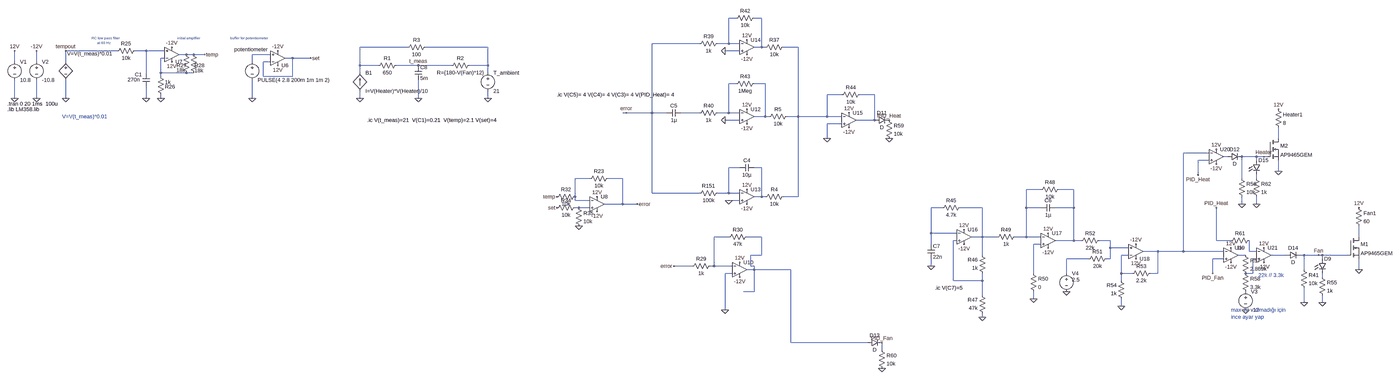
[diagram p0: schematic TRANSFORMERS-ASSEMBLE-9-hizli.asc, whole sheet]
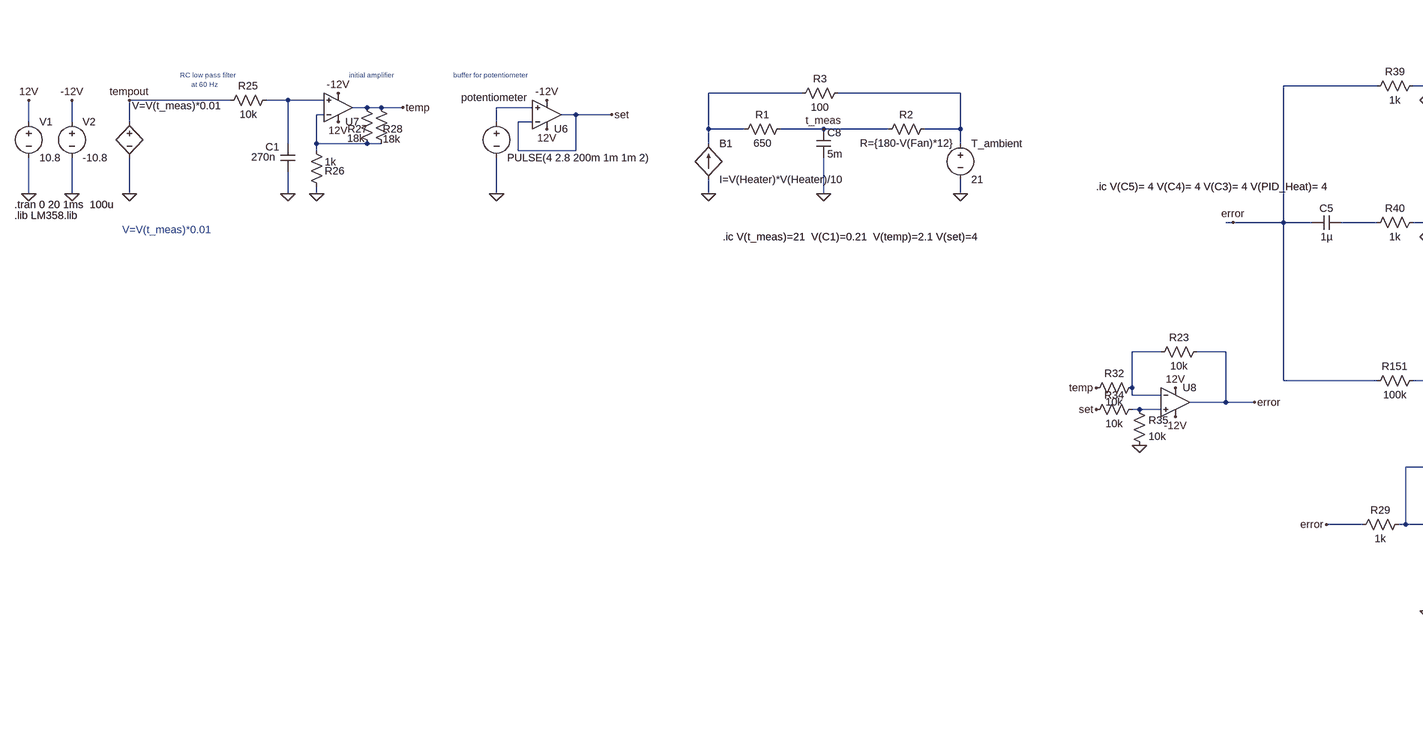
[diagram p1: schematic TRANSFORMERS-ASSEMBLE-9-hizli.asc, part, row 1 of 1, column 1 of 2]
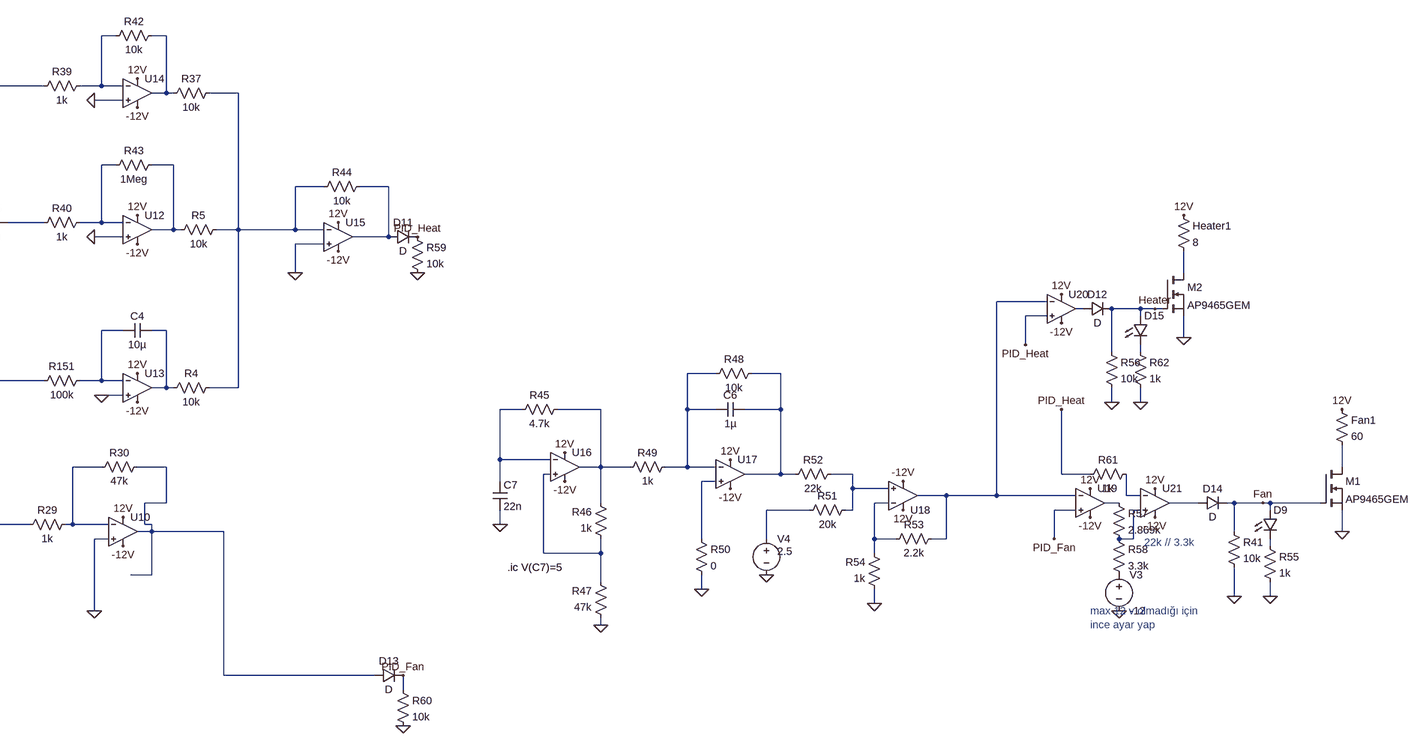
[diagram p2: schematic TRANSFORMERS-ASSEMBLE-9-hizli.asc, part, row 1 of 1, column 2 of 2]
TRANSFORMERS-ASSEMBLE-9-hizli.asc, the LTspice schematic file:
Version 4
SHEET 1 5384 1732
WIRE 2224 -160 2192 -160
WIRE 2336 -160 2304 -160
WIRE 2064 -48 1856 -48
WIRE 2192 -48 2192 -160
WIRE 2192 -48 2144 -48
WIRE 2240 -48 2192 -48
WIRE 576 -32 368 -32
WIRE 928 -32 656 -32
WIRE 2336 -32 2336 -160
WIRE 2336 -32 2304 -32
WIRE 2352 -32 2336 -32
WIRE 2496 -32 2432 -32
WIRE -912 -16 -1136 -16
WIRE -784 -16 -832 -16
WIRE -704 -16 -784 -16
WIRE 2240 -16 2176 -16
WIRE -608 0 -640 0
WIRE -576 0 -608 0
WIRE -528 0 -576 0
WIRE -240 0 -320 0
WIRE -704 16 -720 16
WIRE -144 16 -176 16
WIRE -64 16 -144 16
WIRE -1360 32 -1360 -16
WIRE -1264 32 -1264 -16
WIRE -1136 32 -1136 -16
WIRE -320 32 -320 0
WIRE -240 32 -272 32
WIRE 368 48 368 -32
WIRE 448 48 368 48
WIRE 624 48 528 48
WIRE 768 48 624 48
WIRE 928 48 928 -32
WIRE 928 48 848 48
WIRE -784 80 -784 -16
WIRE -720 80 -720 16
WIRE -608 80 -720 80
WIRE -576 80 -608 80
WIRE 368 80 368 48
WIRE 928 80 928 48
WIRE -720 96 -720 80
WIRE -272 96 -272 32
WIRE -144 96 -144 16
WIRE -144 96 -272 96
WIRE 2224 128 2192 128
WIRE 2352 128 2304 128
WIRE 2720 176 2656 176
WIRE 2864 176 2800 176
WIRE -1360 192 -1360 112
WIRE -1264 192 -1264 112
WIRE -1136 192 -1136 112
WIRE -784 192 -784 144
WIRE -720 192 -720 176
WIRE -320 192 -320 112
WIRE 368 192 368 160
WIRE 624 192 624 112
WIRE 928 192 928 160
WIRE 1744 256 1728 256
WIRE 1856 256 1856 -48
WIRE 1856 256 1744 256
WIRE 1920 256 1856 256
WIRE 2064 256 1984 256
WIRE 2192 256 2192 128
WIRE 2192 256 2144 256
WIRE 2240 256 2192 256
WIRE 2352 272 2352 128
WIRE 2352 272 2304 272
WIRE 2368 272 2352 272
WIRE 2496 272 2496 -32
WIRE 2496 272 2448 272
WIRE 2656 272 2656 176
WIRE 2656 272 2496 272
WIRE 2720 272 2656 272
WIRE 2240 288 2176 288
WIRE 2864 288 2864 176
WIRE 2864 288 2784 288
WIRE 2720 304 2656 304
WIRE 2656 368 2656 304
WIRE 4880 368 4880 320
WIRE 4576 432 4464 432
WIRE 4656 448 4640 448
WIRE 4784 448 4720 448
WIRE 4816 448 4784 448
WIRE 4832 448 4816 448
WIRE 4576 464 4528 464
WIRE 4784 464 4784 448
WIRE 2240 496 2192 496
WIRE 2336 496 2304 496
WIRE 4880 512 4880 464
WIRE 4528 528 4528 464
WIRE 1584 544 1520 544
WIRE 1728 544 1664 544
WIRE 4720 544 4720 448
WIRE 4784 544 4784 528
WIRE 3840 592 3776 592
WIRE 3984 592 3920 592
WIRE 1856 608 1856 256
WIRE 2064 608 1856 608
WIRE 2192 608 2192 496
WIRE 2192 608 2144 608
WIRE 2240 608 2192 608
WIRE 1520 624 1520 544
WIRE 2336 624 2336 496
WIRE 2336 624 2304 624
WIRE 2352 624 2336 624
WIRE 2496 624 2496 272
WIRE 2496 624 2432 624
WIRE 1520 640 1520 624
WIRE 1584 640 1520 640
WIRE 2192 640 2176 640
WIRE 2240 640 2192 640
WIRE 1728 656 1728 544
WIRE 1728 656 1648 656
WIRE 1792 656 1728 656
WIRE 4720 656 4720 624
WIRE 4784 656 4784 624
WIRE 1536 672 1520 672
WIRE 1584 672 1536 672
WIRE 3408 672 3360 672
WIRE 3584 672 3488 672
WIRE 3776 672 3776 592
WIRE 3840 672 3776 672
WIRE 3984 672 3984 592
WIRE 3984 672 3904 672
WIRE 3360 784 3360 672
WIRE 3472 784 3360 784
WIRE 2192 800 2128 800
WIRE 2336 800 2272 800
WIRE 3584 800 3584 672
WIRE 3584 800 3536 800
WIRE 3648 800 3584 800
WIRE 3776 800 3776 672
WIRE 3776 800 3728 800
WIRE 3840 800 3776 800
WIRE 5232 800 5232 752
WIRE 3472 816 3456 816
WIRE 3984 816 3984 672
WIRE 3984 816 3904 816
WIRE 4016 816 3984 816
WIRE 4144 816 4096 816
WIRE 4608 816 4608 672
WIRE 4672 816 4608 816
WIRE 3360 832 3360 784
WIRE 3840 832 3808 832
WIRE 4144 848 4144 816
WIRE 4224 848 4144 848
WIRE 4352 864 4288 864
WIRE 4464 864 4464 432
WIRE 4464 864 4352 864
WIRE 4640 864 4464 864
WIRE 4752 864 4752 816
WIRE 4784 864 4752 864
WIRE 2336 880 2336 800
WIRE 2336 880 2288 880
WIRE 3584 880 3584 800
WIRE 4224 880 4192 880
WIRE 4736 880 4704 880
WIRE 4912 880 4848 880
WIRE 4992 880 4976 880
WIRE 5056 880 4992 880
WIRE 5072 880 5056 880
WIRE 5184 880 5072 880
WIRE 4048 896 3952 896
WIRE 4144 896 4144 848
WIRE 4144 896 4128 896
WIRE 4640 896 4592 896
WIRE 4784 896 4768 896
WIRE 5072 896 5072 880
WIRE 2032 928 1952 928
WIRE 2128 928 2128 800
WIRE 2128 928 2112 928
WIRE 2208 928 2128 928
WIRE 2288 928 2288 880
WIRE 2304 928 2288 928
WIRE 3360 928 3360 896
WIRE 2304 944 2304 928
WIRE 2304 944 2272 944
WIRE 2464 944 2304 944
WIRE 4992 944 4992 880
WIRE 5232 944 5232 896
WIRE 2208 960 2176 960
WIRE 3808 960 3808 832
WIRE 3952 960 3952 896
WIRE 4192 960 4192 880
WIRE 4240 960 4192 960
WIRE 4352 960 4352 864
WIRE 4352 960 4320 960
WIRE 4592 960 4592 896
WIRE 4768 960 4768 896
WIRE 4768 960 4736 960
WIRE 5072 976 5072 960
WIRE 3456 992 3456 816
WIRE 3584 992 3584 960
WIRE 3584 992 3456 992
WIRE 4192 992 4192 960
WIRE 2304 1040 2304 944
WIRE 2304 1040 2256 1040
WIRE 3584 1056 3584 992
WIRE 3808 1072 3808 1040
WIRE 4992 1088 4992 1024
WIRE 5072 1088 5072 1056
WIRE 4192 1104 4192 1072
WIRE 2176 1120 2176 960
WIRE 3584 1152 3584 1136
WIRE 2464 1264 2464 944
WIRE 2832 1264 2464 1264
WIRE 2896 1296 2896 1264
FLAG -1360 192 0
FLAG -1360 -16 12V
FLAG -1264 192 0
FLAG -1264 -16 -12V
FLAG -1136 192 0
FLAG -672 -32 -12V
FLAG -672 32 12V
FLAG -784 192 0
FLAG -720 192 0
FLAG -528 0 temp
FLAG -320 192 0
FLAG -208 -16 -12V
FLAG -208 48 12V
FLAG -64 16 set
FLAG 928 192 0
FLAG 368 192 0
FLAG 624 192 0
FLAG 624 48 t_meas
FLAG -1136 -16 tempout
FLAG 2240 976 -12V
FLAG 2240 912 12V
FLAG 2896 1264 PID_Fan
FLAG 2272 304 -12V
FLAG 2272 240 12V
FLAG 2272 656 -12V
FLAG 2272 592 12V
FLAG 2272 0 -12V
FLAG 2272 -64 12V
FLAG 2752 320 -12V
FLAG 2752 256 12V
FLAG 2656 368 0
FLAG 2928 288 PID_Heat
FLAG 3504 832 -12V
FLAG 3504 768 12V
FLAG 3360 928 0
FLAG 3584 1152 0
FLAG 3808 1072 0
FLAG 3872 848 -12V
FLAG 3872 784 12V
FLAG 4256 832 -12V
FLAG 4256 896 12V
FLAG 4192 1104 0
FLAG 4672 912 -12V
FLAG 4672 848 12V
FLAG 4592 960 PID_Fan
FLAG 5056 880 Fan
FLAG 5232 944 0
FLAG 5072 1088 0
FLAG 4608 480 -12V
FLAG 4608 416 12V
FLAG 4528 528 PID_Heat
FLAG 4816 448 Heater
FLAG 4880 512 0
FLAG 4720 656 0
FLAG 5232 672 12V
FLAG 4880 240 12V
FLAG 4816 912 -12V
FLAG 4816 848 12V
FLAG 4608 672 PID_Heat
FLAG 3952 1040 0
FLAG 2928 368 0
FLAG 2896 1376 0
FLAG 4992 1088 0
FLAG 4784 656 0
FLAG 1616 688 -12V
FLAG 1616 624 12V
FLAG 1536 752 0
FLAG 1440 672 set
FLAG 1440 624 temp
FLAG 1792 656 error
FLAG 2192 640 0
FLAG 2176 288 0
FLAG 2176 -16 0
FLAG 1744 256 error
FLAG 2176 1120 0
FLAG 1952 928 error
FLAG 4736 1120 0
SYMBOL voltage -1360 16 R0
WINDOW 123 0 0 Left 0
WINDOW 39 0 0 Left 0
SYMATTR InstName V1
SYMATTR Value 10.8
SYMBOL voltage -1264 16 R0
WINDOW 123 0 0 Left 0
WINDOW 39 0 0 Left 0
SYMATTR InstName V2
SYMATTR Value -10.8
SYMBOL bv -1136 16 R0
WINDOW 0 -36 10 Invisible 2
WINDOW 3 6 -20 Left 2
SYMATTR InstName B2
SYMATTR Value V=V(t_meas)*0.01
SYMBOL res -816 -32 R90
WINDOW 0 0 56 VBottom 2
WINDOW 3 32 56 VTop 2
SYMATTR InstName R25
SYMATTR Value 10k
SYMBOL cap -800 80 R0
WINDOW 0 -34 8 Left 2
WINDOW 3 -65 30 Left 2
SYMATTR InstName C1
SYMATTR Value 270n
SYMBOL res -736 80 R0
WINDOW 0 34 61 Left 2
WINDOW 3 34 41 Left 2
SYMATTR InstName R26
SYMATTR Value 1k
SYMBOL res -624 -16 R0
WINDOW 0 -27 64 Left 2
WINDOW 3 -28 85 Left 2
SYMATTR InstName R27
SYMATTR Value 18k
SYMBOL res -592 -16 R0
WINDOW 0 19 64 Left 2
WINDOW 3 19 86 Left 2
SYMATTR InstName R28
SYMATTR Value 18k
SYMBOL voltage -320 16 R0
WINDOW 0 -79 -38 Left 2
WINDOW 123 0 0 Left 0
WINDOW 39 0 0 Left 0
SYMATTR InstName potentiometer
SYMATTR Value PULSE(4 2.8 200m 1m 1m 2)
SYMBOL voltage 928 64 R0
WINDOW 123 0 0 Left 0
WINDOW 39 0 0 Left 0
SYMATTR InstName T_ambient
SYMATTR Value 21
SYMBOL res 544 32 R90
WINDOW 0 0 56 VBottom 2
WINDOW 3 32 56 VTop 2
SYMATTR InstName R1
SYMATTR Value 650
SYMBOL res 864 32 R90
WINDOW 0 0 56 VBottom 2
WINDOW 3 32 56 VTop 2
SYMATTR InstName R2
SYMATTR Value R={180-V(Fan)*12}
SYMBOL res 672 -48 R90
WINDOW 0 0 56 VBottom 2
WINDOW 3 32 56 VTop 2
SYMATTR InstName R3
SYMATTR Value 100
SYMBOL Opamps\\UniversalOpamp2 2240 944 R0
SYMATTR InstName U10
SYMBOL Opamps\\UniversalOpamp2 2272 272 R0
SYMATTR InstName U12
SYMBOL Opamps\\UniversalOpamp2 2272 624 R0
SYMATTR InstName U13
SYMBOL Opamps\\UniversalOpamp2 2272 -32 R0
SYMATTR InstName U14
SYMBOL Opamps\\UniversalOpamp2 2752 288 R0
SYMATTR InstName U15
SYMBOL res 2448 -48 R90
WINDOW 0 0 56 VBottom 2
WINDOW 3 32 56 VTop 2
SYMATTR InstName R37
SYMATTR Value 10k
SYMBOL res 2160 -64 R90
WINDOW 0 0 56 VBottom 2
WINDOW 3 32 56 VTop 2
SYMATTR InstName R39
SYMATTR Value 1k
SYMBOL res 2160 240 R90
WINDOW 0 0 56 VBottom 2
WINDOW 3 32 56 VTop 2
SYMATTR InstName R40
SYMATTR Value 1k
SYMBOL res 2160 592 R90
WINDOW 0 0 56 VBottom 2
WINDOW 3 32 56 VTop 2
SYMATTR InstName R151
SYMATTR Value 100k
SYMBOL res 2320 -176 R90
WINDOW 0 0 56 VBottom 2
WINDOW 3 32 56 VTop 2
SYMATTR InstName R42
SYMATTR Value 10k
SYMBOL res 2320 112 R90
WINDOW 0 0 56 VBottom 2
WINDOW 3 32 56 VTop 2
SYMATTR InstName R43
SYMATTR Value 1Meg
SYMBOL cap 2304 480 R90
WINDOW 0 0 32 VBottom 2
WINDOW 3 32 32 VTop 2
SYMATTR InstName C4
SYMATTR Value 10µ
SYMBOL cap 1984 240 R90
WINDOW 0 0 32 VBottom 2
WINDOW 3 32 32 VTop 2
SYMATTR InstName C5
SYMATTR Value 1µ
SYMBOL res 2816 160 R90
WINDOW 0 0 56 VBottom 2
WINDOW 3 32 56 VTop 2
SYMATTR InstName R44
SYMATTR Value 10k
SYMBOL cap 3904 656 R90
WINDOW 0 0 32 VBottom 2
WINDOW 3 32 32 VTop 2
SYMATTR InstName C6
SYMATTR Value 1µ
SYMBOL res 3504 656 R90
WINDOW 0 0 56 VBottom 2
WINDOW 3 32 56 VTop 2
SYMATTR InstName R45
SYMATTR Value 4.7k
SYMBOL res 3600 976 R180
WINDOW 0 36 76 Left 2
WINDOW 3 36 40 Left 2
SYMATTR InstName R46
SYMATTR Value 1k
SYMBOL res 3600 1152 R180
WINDOW 0 36 76 Left 2
WINDOW 3 36 40 Left 2
SYMATTR InstName R47
SYMATTR Value 47k
SYMBOL res 3936 576 R90
WINDOW 0 0 56 VBottom 2
WINDOW 3 32 56 VTop 2
SYMATTR InstName R48
SYMATTR Value 10k
SYMBOL Opamps\\UniversalOpamp2 3504 800 R0
SYMATTR InstName U16
SYMBOL res 3744 784 R90
WINDOW 0 0 56 VBottom 2
WINDOW 3 32 56 VTop 2
SYMATTR InstName R49
SYMATTR Value 1k
SYMBOL res 3792 944 R0
SYMATTR InstName R50
SYMATTR Value 0
SYMBOL res 4144 880 R90
WINDOW 0 0 56 VBottom 2
WINDOW 3 32 56 VTop 2
SYMATTR InstName R51
SYMATTR Value 20k
SYMBOL res 4000 832 R270
WINDOW 0 32 56 VTop 2
WINDOW 3 0 56 VBottom 2
SYMATTR InstName R52
SYMATTR Value 22k
SYMBOL Opamps\\UniversalOpamp2 3872 816 R0
SYMATTR InstName U17
SYMBOL Opamps\\UniversalOpamp2 4256 864 M180
SYMATTR InstName U18
SYMBOL res 4336 944 R90
WINDOW 0 0 56 VBottom 2
WINDOW 3 32 56 VTop 2
SYMATTR InstName R53
SYMATTR Value 2.2k
SYMBOL res 4208 1088 R180
WINDOW 0 36 76 Left 2
WINDOW 3 36 40 Left 2
SYMATTR InstName R54
SYMATTR Value 1k
SYMBOL nmos 5184 800 R0
SYMATTR InstName M1
SYMATTR Value AP9465GEM
SYMBOL LED 5056 896 R0
WINDOW 3 24 64 Invisible 2
SYMATTR Value NSSW008CT-P1
SYMATTR InstName D9
SYMATTR Description Diode
SYMATTR Type diode
SYMBOL res 5056 960 R0
SYMATTR InstName R55
SYMATTR Value 1k
SYMBOL res 5216 656 R0
SYMATTR InstName Fan1
SYMATTR Value 60
SYMBOL Opamps\\UniversalOpamp2 4608 448 R0
SYMATTR InstName U20
SYMBOL nmos 4832 368 R0
SYMATTR InstName M2
SYMATTR Value AP9465GEM
SYMBOL res 4704 528 R0
SYMATTR InstName R56
SYMATTR Value 10k
SYMBOL res 4864 224 R0
SYMATTR InstName Heater1
SYMATTR Value 8
SYMBOL Opamps\\UniversalOpamp2 4816 880 R0
SYMATTR InstName U21
SYMBOL res 4720 864 R0
SYMATTR InstName R57
SYMATTR Value 2.869k
SYMBOL res 4720 944 R0
SYMATTR InstName R58
SYMATTR Value 3.3k
SYMBOL voltage 3952 944 R0
WINDOW 123 0 0 Left 0
WINDOW 39 0 0 Left 0
WINDOW 3 24 44 Left 2
SYMATTR Value 2.5
SYMATTR InstName V4
SYMBOL cap 3344 832 R0
SYMATTR InstName C7
SYMATTR Value 22n
SYMBOL cap 608 48 R0
SYMATTR InstName C8
SYMATTR Value 5m
SYMBOL bi2 368 80 R0
SYMATTR InstName B1
SYMATTR Value I=V(Heater)*V(Heater)/10
SYMBOL diode 4656 464 R270
WINDOW 0 32 32 VTop 2
WINDOW 3 0 32 VBottom 2
SYMATTR InstName D12
SYMBOL diode 2864 304 R270
WINDOW 0 32 32 VTop 2
WINDOW 3 0 32 VBottom 2
SYMATTR InstName D11
SYMBOL diode 2832 1280 R270
WINDOW 0 32 32 VTop 2
WINDOW 3 0 32 VBottom 2
SYMATTR InstName D13
SYMBOL diode 4912 896 R270
WINDOW 0 32 32 VTop 2
WINDOW 3 0 32 VBottom 2
SYMATTR InstName D14
SYMBOL res 2912 272 R0
SYMATTR InstName R59
SYMATTR Value 10k
SYMBOL res 2880 1280 R0
SYMATTR InstName R60
SYMATTR Value 10k
SYMBOL Opamps\\UniversalOpamp2 -208 16 M180
SYMATTR InstName U6
SYMBOL Opamps\\UniversalOpamp2 -672 0 M180
SYMATTR InstName U7
SYMBOL res 4976 928 R0
SYMATTR InstName R41
SYMATTR Value 10k
SYMBOL res 4768 800 R90
WINDOW 0 0 56 VBottom 2
WINDOW 3 32 56 VTop 2
SYMATTR InstName R61
SYMATTR Value 1k
SYMBOL res 4768 528 R0
SYMATTR InstName R62
SYMATTR Value 1k
SYMBOL LED 4768 464 R0
WINDOW 3 24 64 Invisible 2
SYMATTR Value NSSW008CT-P1
SYMATTR InstName D15
SYMATTR Description Diode
SYMATTR Type diode
SYMBOL Opamps\\UniversalOpamp2 4672 880 R0
SYMATTR InstName U19
SYMBOL Opamps\\UniversalOpamp2 1616 656 R0
SYMATTR InstName U8
SYMBOL res 1680 528 R90
WINDOW 0 0 56 VBottom 2
WINDOW 3 32 56 VTop 2
SYMATTR InstName R23
SYMATTR Value 10k
SYMBOL res 1536 608 R90
WINDOW 0 0 56 VBottom 2
WINDOW 3 32 56 VTop 2
SYMATTR InstName R32
SYMATTR Value 10k
SYMBOL res 1536 656 R90
WINDOW 0 0 56 VBottom 2
WINDOW 3 32 56 VTop 2
SYMATTR InstName R34
SYMATTR Value 10k
SYMBOL res 1520 656 R0
SYMATTR InstName R35
SYMATTR Value 10k
SYMBOL res 2288 784 R90
WINDOW 0 0 56 VBottom 2
WINDOW 3 32 56 VTop 2
SYMATTR InstName R30
SYMATTR Value 47k
SYMBOL res 2128 912 R90
WINDOW 0 0 56 VBottom 2
WINDOW 3 32 56 VTop 2
SYMATTR InstName R29
SYMATTR Value 1k
SYMBOL res 2448 608 R90
WINDOW 0 0 56 VBottom 2
WINDOW 3 32 56 VTop 2
SYMATTR InstName R4
SYMATTR Value 10k
SYMBOL res 2464 256 R90
WINDOW 0 0 56 VBottom 2
WINDOW 3 32 56 VTop 2
SYMATTR InstName R5
SYMATTR Value 10k
SYMBOL voltage 4736 1024 R0
WINDOW 123 0 0 Left 0
WINDOW 39 0 0 Left 0
SYMATTR InstName V3
SYMATTR Value -12
TEXT -1024 -72 Left 1 ;RC low pass filter\n      at 60 Hz
TEXT -648 -72 Left 1 ;initial amplifier
TEXT -416 -72 Left 1 ;buffer for potentiometer
TEXT -1392 216 Left 2 !.tran 0 20 1ms  100u
TEXT -1392 240 Left 2 !.lib LM358.lib
TEXT 400 288 Left 2 !.ic V(t_meas)=21  V(C1)=0.21  V(temp)=2.1 V(set)=4
TEXT -1152 272 Left 2 ;V=V(t_meas)*0.01
TEXT 3376 1024 Left 2 !.ic V(C7)=5
TEXT 1440 176 Left 2 !.ic V(C5)= 4 V(C4)= 4 V(C3)= 4 V(PID_Heat)= 4
TEXT 4672 1120 Left 2 ;max 12 v olmadığı için\nince ayar yap
TEXT 4792 968 Left 2 ;22k // 3.3k

The netlist it stands for:
* TRANSFORMERS-ASSEMBLE-9-hizli.asc
V1 12V 0 10.8
V2 -12V 0 -10.8
B2 tempout 0 V=V(t_meas)*0.01
R25 N006 tempout 10k
C1 N006 0 270n
R26 N008 0 1k
R27 temp N008 18k
R28 temp N008 18k
V§potentiometer N007 0 PULSE(4 2.8 200m 1m 1m 2)
V§T_ambient N004 0 21
R1 t_meas N003 650
R2 N004 t_meas R={180-V(Fan)*12}
R3 N004 N003 100
XU10 0 N025 12V -12V N026 level.2 Avol=1Meg GBW=10Meg Slew=10Meg ilimit=25m rail=0 Vos=0 phimargin=45 en=0 enk=0 in=0 ink=0 Rin=500Meg  ; pins IN+ IN- V+ V- OUT
XU12 0 N009 12V -12V N010 level.2 Avol=1Meg GBW=10Meg Slew=10Meg ilimit=25m rail=0 Vos=0 phimargin=45 en=0 enk=0 in=0 ink=0 Rin=500Meg  ; pins IN+ IN- V+ V- OUT
XU13 0 N016 12V -12V N017 level.2 Avol=1Meg GBW=10Meg Slew=10Meg ilimit=25m rail=0 Vos=0 phimargin=45 en=0 enk=0 in=0 ink=0 Rin=500Meg  ; pins IN+ IN- V+ V- OUT
XU14 0 N001 12V -12V N002 level.2 Avol=1Meg GBW=10Meg Slew=10Meg ilimit=25m rail=0 Vos=0 phimargin=45 en=0 enk=0 in=0 ink=0 Rin=500Meg  ; pins IN+ IN- V+ V- OUT
XU15 0 N005 12V -12V N011 level.2 Avol=1Meg GBW=10Meg Slew=10Meg ilimit=25m rail=0 Vos=0 phimargin=45 en=0 enk=0 in=0 ink=0 Rin=500Meg  ; pins IN+ IN- V+ V- OUT
R37 N005 N002 10k
R39 N001 error 1k
R40 N009 N012 1k
R151 N016 error 100k
R42 N002 N001 10k
R43 N010 N009 1Meg
C4 N017 N016 10µ
C5 N012 error 1µ
R44 N011 N005 10k
C6 N021 N020 1µ
R45 N024 N023 4.7k
R46 N028 N024 1k
R47 0 N028 47k
R48 N021 N020 10k
XU16 N028 N023 12V -12V N024 level.2 Avol=1Meg GBW=10Meg Slew=10Meg ilimit=25m rail=0 Vos=0 phimargin=45 en=0 enk=0 in=0 ink=0 Rin=500Meg  ; pins IN+ IN- V+ V- OUT
R49 N020 N024 1k
R50 N030 0 0
R51 N029 N035 20k
R52 N021 N029 22k
XU17 N030 N020 12V -12V N021 level.2 Avol=1Meg GBW=10Meg Slew=10Meg ilimit=25m rail=0 Vos=0 phimargin=45 en=0 enk=0 in=0 ink=0 Rin=500Meg  ; pins IN+ IN- V+ V- OUT
XU18 N029 N032 12V -12V N014 level.2 Avol=1Meg GBW=10Meg Slew=10Meg ilimit=25m rail=0 Vos=0 phimargin=45 en=0 enk=0 in=0 ink=0 Rin=500Meg  ; pins IN+ IN- V+ V- OUT
R53 N014 N032 2.2k
R54 0 N032 1k
M1 N027 Fan 0 0 AP9465GEM
D9 Fan N037 NSSW008CT-P1
R55 N037 0 1k
R§Fan1 12V N027 60
XU20 PID_Heat N014 12V -12V N015 level.2 Avol=1Meg GBW=10Meg Slew=10Meg ilimit=25m rail=0 Vos=0 phimargin=45 en=0 enk=0 in=0 ink=0 Rin=500Meg  ; pins IN+ IN- V+ V- OUT
M2 N013 Heater 0 0 AP9465GEM
R56 Heater 0 10k
R§Heater1 12V N013 8
XU21 N036 N031 12V -12V N034 level.2 Avol=1Meg GBW=10Meg Slew=10Meg ilimit=25m rail=0 Vos=0 phimargin=45 en=0 enk=0 in=0 ink=0 Rin=500Meg  ; pins IN+ IN- V+ V- OUT
R57 N033 N036 2.869k
R58 N036 P001 3.3k
V4 N035 0 2.5
C7 N023 0 22n
C8 t_meas 0 5m
B1 0 N003 I=V(Heater)*V(Heater)/10
D12 N015 Heater D
D11 N011 PID_Heat D
D13 N026 PID_Fan D
D14 N034 Fan D
R59 PID_Heat 0 10k
R60 PID_Fan 0 10k
XU6 N007 set 12V -12V set level.2 Avol=1Meg GBW=10Meg Slew=10Meg ilimit=25m rail=0 Vos=0 phimargin=45 en=0 enk=0 in=0 ink=0 Rin=500Meg  ; pins IN+ IN- V+ V- OUT
XU7 N006 N008 12V -12V temp level.2 Avol=1Meg GBW=10Meg Slew=10Meg ilimit=25m rail=0 Vos=0 phimargin=45 en=0 enk=0 in=0 ink=0 Rin=500Meg  ; pins IN+ IN- V+ V- OUT
R41 Fan 0 10k
R61 N031 PID_Heat 1k
R62 N019 0 1k
D15 Heater N019 NSSW008CT-P1
XU19 PID_Fan N014 12V -12V N033 level.2 Avol=1Meg GBW=10Meg Slew=10Meg ilimit=25m rail=0 Vos=0 phimargin=45 en=0 enk=0 in=0 ink=0 Rin=500Meg  ; pins IN+ IN- V+ V- OUT
XU8 N022 N018 12V -12V error level.2 Avol=1Meg GBW=10Meg Slew=10Meg ilimit=25m rail=0 Vos=0 phimargin=45 en=0 enk=0 in=0 ink=0 Rin=500Meg  ; pins IN+ IN- V+ V- OUT
R23 error N018 10k
R32 N018 temp 10k
R34 N022 set 10k
R35 N022 0 10k
R30 N026 N025 47k
R29 N025 error 1k
R4 N005 N017 10k
R5 N005 N010 10k
V3 P001 0 -12
.model D D
.lib standard.dio
.model NMOS NMOS
.model PMOS PMOS
.lib standard.mos
* RC low pass filter
*       at 60 Hz
* initial amplifier
* buffer for potentiometer
.tran 0 20 1ms  100u
.lib LM358.lib
.ic V(t_meas)=21  V(C1)=0.21  V(temp)=2.1 V(set)=4
* V=V(t_meas)*0.01
.ic V(C7)=5
.ic V(C5)= 4 V(C4)= 4 V(C3)= 4 V(PID_Heat)= 4
* max 12 v olmadığı için
* ince ayar yap
* 22k // 3.3k
.lib UniversalOpamps2.sub
.backanno
.end